# Altium schematic sheet 3_power.SchDoc
size A4
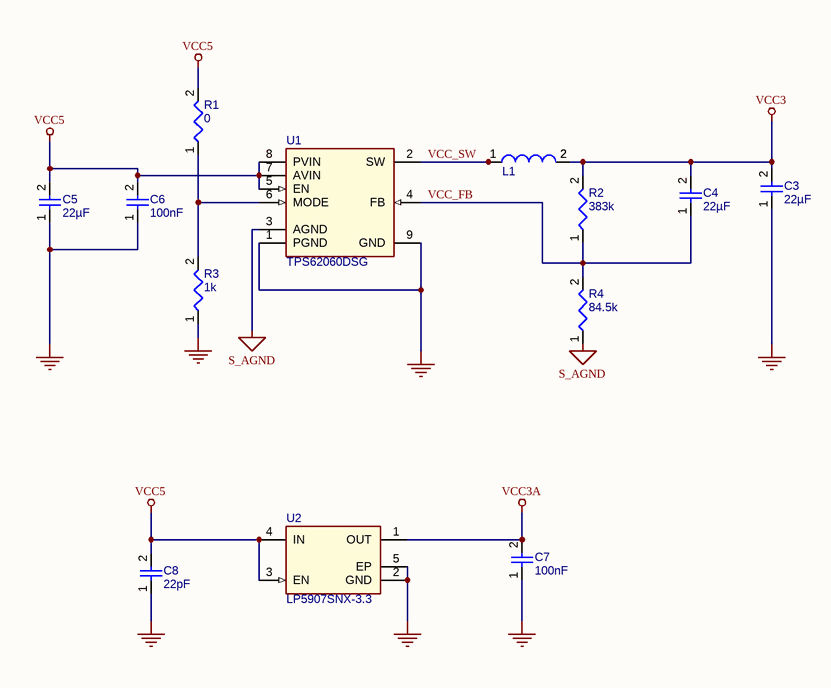
[diagram p0: 3_power.SchDoc]

## Parts
C3  value 22µF  [CAPC0805(2012)145_L]  (hidden comment: Capacitor 22µF +/-40% 16V 0805)
C4  value 22µF  [CAPC0805(2012)145_L]  (hidden comment: Capacitor 22µF +/-40% 16V 0805)
C5  value 22µF  [CAPC0805(2012)145_L]  (hidden comment: Capacitor 22µF +/-40% 16V 0805)
C6  value 100nF  [CAPC0402(1005)60_L]  (hidden comment: Capacitor 100nF +/-20% 10V 0402)
C7  value 100nF  [CAPC0402(1005)60_L]  (hidden comment: Capacitor 100nF +/-20% 10V 0402)
C8  value 22pF  [CAPC0402(1005)60_L]  (hidden comment: Capacitor 22pF +/-10% 50V 0402)
L1  VLS252010HBX-2R2M-1  [TDK-VLS252010_V]  (value not drawn)
R1  value 0  [RESC0402(1005)_L]  (hidden comment: Jumper 0402)
R2  value 383k  [RESC0402(1005)_L]  (hidden comment: Resistor 383K +/-1 % 0402 63 mW)
R3  value 1k  [RESC0402(1005)_L]  (hidden comment: Resistor 1K +/-5 % 0402 63 mW)
R4  value 84.5k  [RESC0402(1005)_L]  (hidden comment: Resistor 84K5 +/-1 % 0402 63 mW)
U1  TPS62060DSG  [DSG0008A_V]
U2  LP5907SNX-3.3  [TI-DQN4-480X480TP_V]

## Nets
GND: C3.1 C5.1 C6.1 C7.1 C8.1 R3.1 U1.1(PGND) U1.9(GND) U2.2(GND) U2.5(EP)
S_AGND: R4.1 U1.3(AGND)
VCC3: C3.2 C4.2 L1.2 R2.2
VCC3A: C7.2 U2.1(OUT)
VCC5: C5.2 C6.2 C8.2 R1.2 U1.5(EN) U1.7(AVIN) U1.8(PVIN) U2.3(EN) U2.4(IN)
VCC_FB: C4.1 R2.1 R4.2 U1.4(FB)
VCC_SW: L1.1 U1.2(SW)
NetR1_1: R1.1 R3.2 U1.6(MODE)

## Library data of the parts
C3-C5 = Capacitor 22µF +/-40% 16V 0805: Chip Capacitor, 22µF +/-40%, 16V, 0805, Thickness 1.45 mm; Manufacturer: Murata; Manufacturer Part Number: GRM21BR61C226ME44L; Tolerance: 5%; Voltage Rating: 16V; Case/Package: 0402; Pins: 2; Mounting Technology: SMT; Max Operating Temperature: 85°C; Min Operating Temperature: -55°C; Component Type: Capacitors
C6 C7 = Capacitor 100nF +/-20% 10V 0402: Chip Capacitor, 100nF +/-20%, 10V, 0402, Thickness 0.6 mm; Manufacturer: KEMET; Manufacturer Part Number: C0402C104K8RAC; Tolerance: 20%; Case/Package: 0402; Min Operating Temperature: -55°C; Mounting Technology: SMT; Max Operating Temperature: 85°C; Pins: 2; Voltage Rating: 10V; Component Type: Capacitors
C8 = Capacitor 22pF +/-10% 50V 0402: Chip Capacitor, 22pF +/-10%, 50V, 0402, Thickness 0.6 mm; Manufacturer: Kyocera AVX; Manufacturer Part Number: 04025A220JAT4A; Tolerance: 10%; Mounting Technology: SMT; Pins: 2; Voltage Rating: 50V; Case/Package: 0402; Max Operating Temperature: 85°C; Min Operating Temperature: -55°C; Component Type: Capacitors
L1 = VLS252010HBX-2R2M-1: Inductor for Power Circuit, 2.2 uH, +/- 20%, -40 to 105 degC, 2-Pin SMD, RoHS, Tape and Reel; Manufacturer: TDK; Tolerance: 20%; Mounting Technology: SurfaceMount; Pins: 2; Manufacturer Part Number: VLS252010HBX-2R2M-1; Component Type: Inductors
R1 = Jumper 0402: Manufacturer: Yageo; Manufacturer Part Number: RC0402JR-070RL; Case/Package: 0402; Max Operating Temperature: 155°C; Min Operating Temperature: -55°C; Pins: 2; Component Type: Resistors
R2 = Resistor 383K +/-1 % 0402 63 mW: Chip Resistor, 383 kOhms, +/-1 %, 63 mW, -55 to 155 degC, 0402; Manufacturer: Vishay; Manufacturer Part Number: CRCW0402383KFKED; Tolerance: 1%; Power: 63mW; Case/Package: 0402; Max Operating Temperature: 155°C; Min Operating Temperature: -55°C; Pins: 2; Component Type: Resistors
R3 = Resistor 1K +/-5 % 0402 63 mW: Chip Resistor, 1 kOhms, +/-5 %, 63 mW, -55 to 155 degC, 0402; Manufacturer: Yageo; Manufacturer Part Number: RC0402JR-071KL; Tolerance: 5%; Power: 63mW; Case/Package: 0402; Max Operating Temperature: 155°C; Min Operating Temperature: -55°C; Pins: 2; Component Type: Resistors
R4 = Resistor 84K5 +/-1 % 0402 63 mW: Chip Resistor, 84,5 kOhms, +/-1 %, 63 mW, -55 to 155 degC, 0402; Manufacturer: Vishay Dale; Manufacturer Part Number: CRCW040284K5FKTD; Tolerance: 1%; Power: 63mW; Case/Package: 0402; Max Operating Temperature: 155°C; Min Operating Temperature: -55°C; Pins: 2; Component Type: Resistors
U1 = TPS62060DSG: Step Down Converter, 3 MHz, 1.6 A, -45 to 85 degC, 8-Pin WSON, RoHS, Tape and Reel; Manufacturer: Texas Instruments; Manufacturer Part Number: TPS62060DSGR; Pins: 9; Component Type: Power Supply
U2 = LP5907SNX-3.3: Ultra-Low-Noise, Low-IQ LDO, 3.3 V, 0.25 A, -40 to 125 degC, 4-Pin X2SON, RoHS, Tape and Reel; Manufacturer: Texas Instruments; Manufacturer Part Number: LP5907SNX-3.3/NOPB; Output Voltage: 3.3V; Min Operating Temperature: -40°C; Pins: 5; Max Operating Temperature: 125°C; Component Type: Power Supply